# EAGLE design SafePrinterBoard_0_6 (EAGLE 9.6.2)
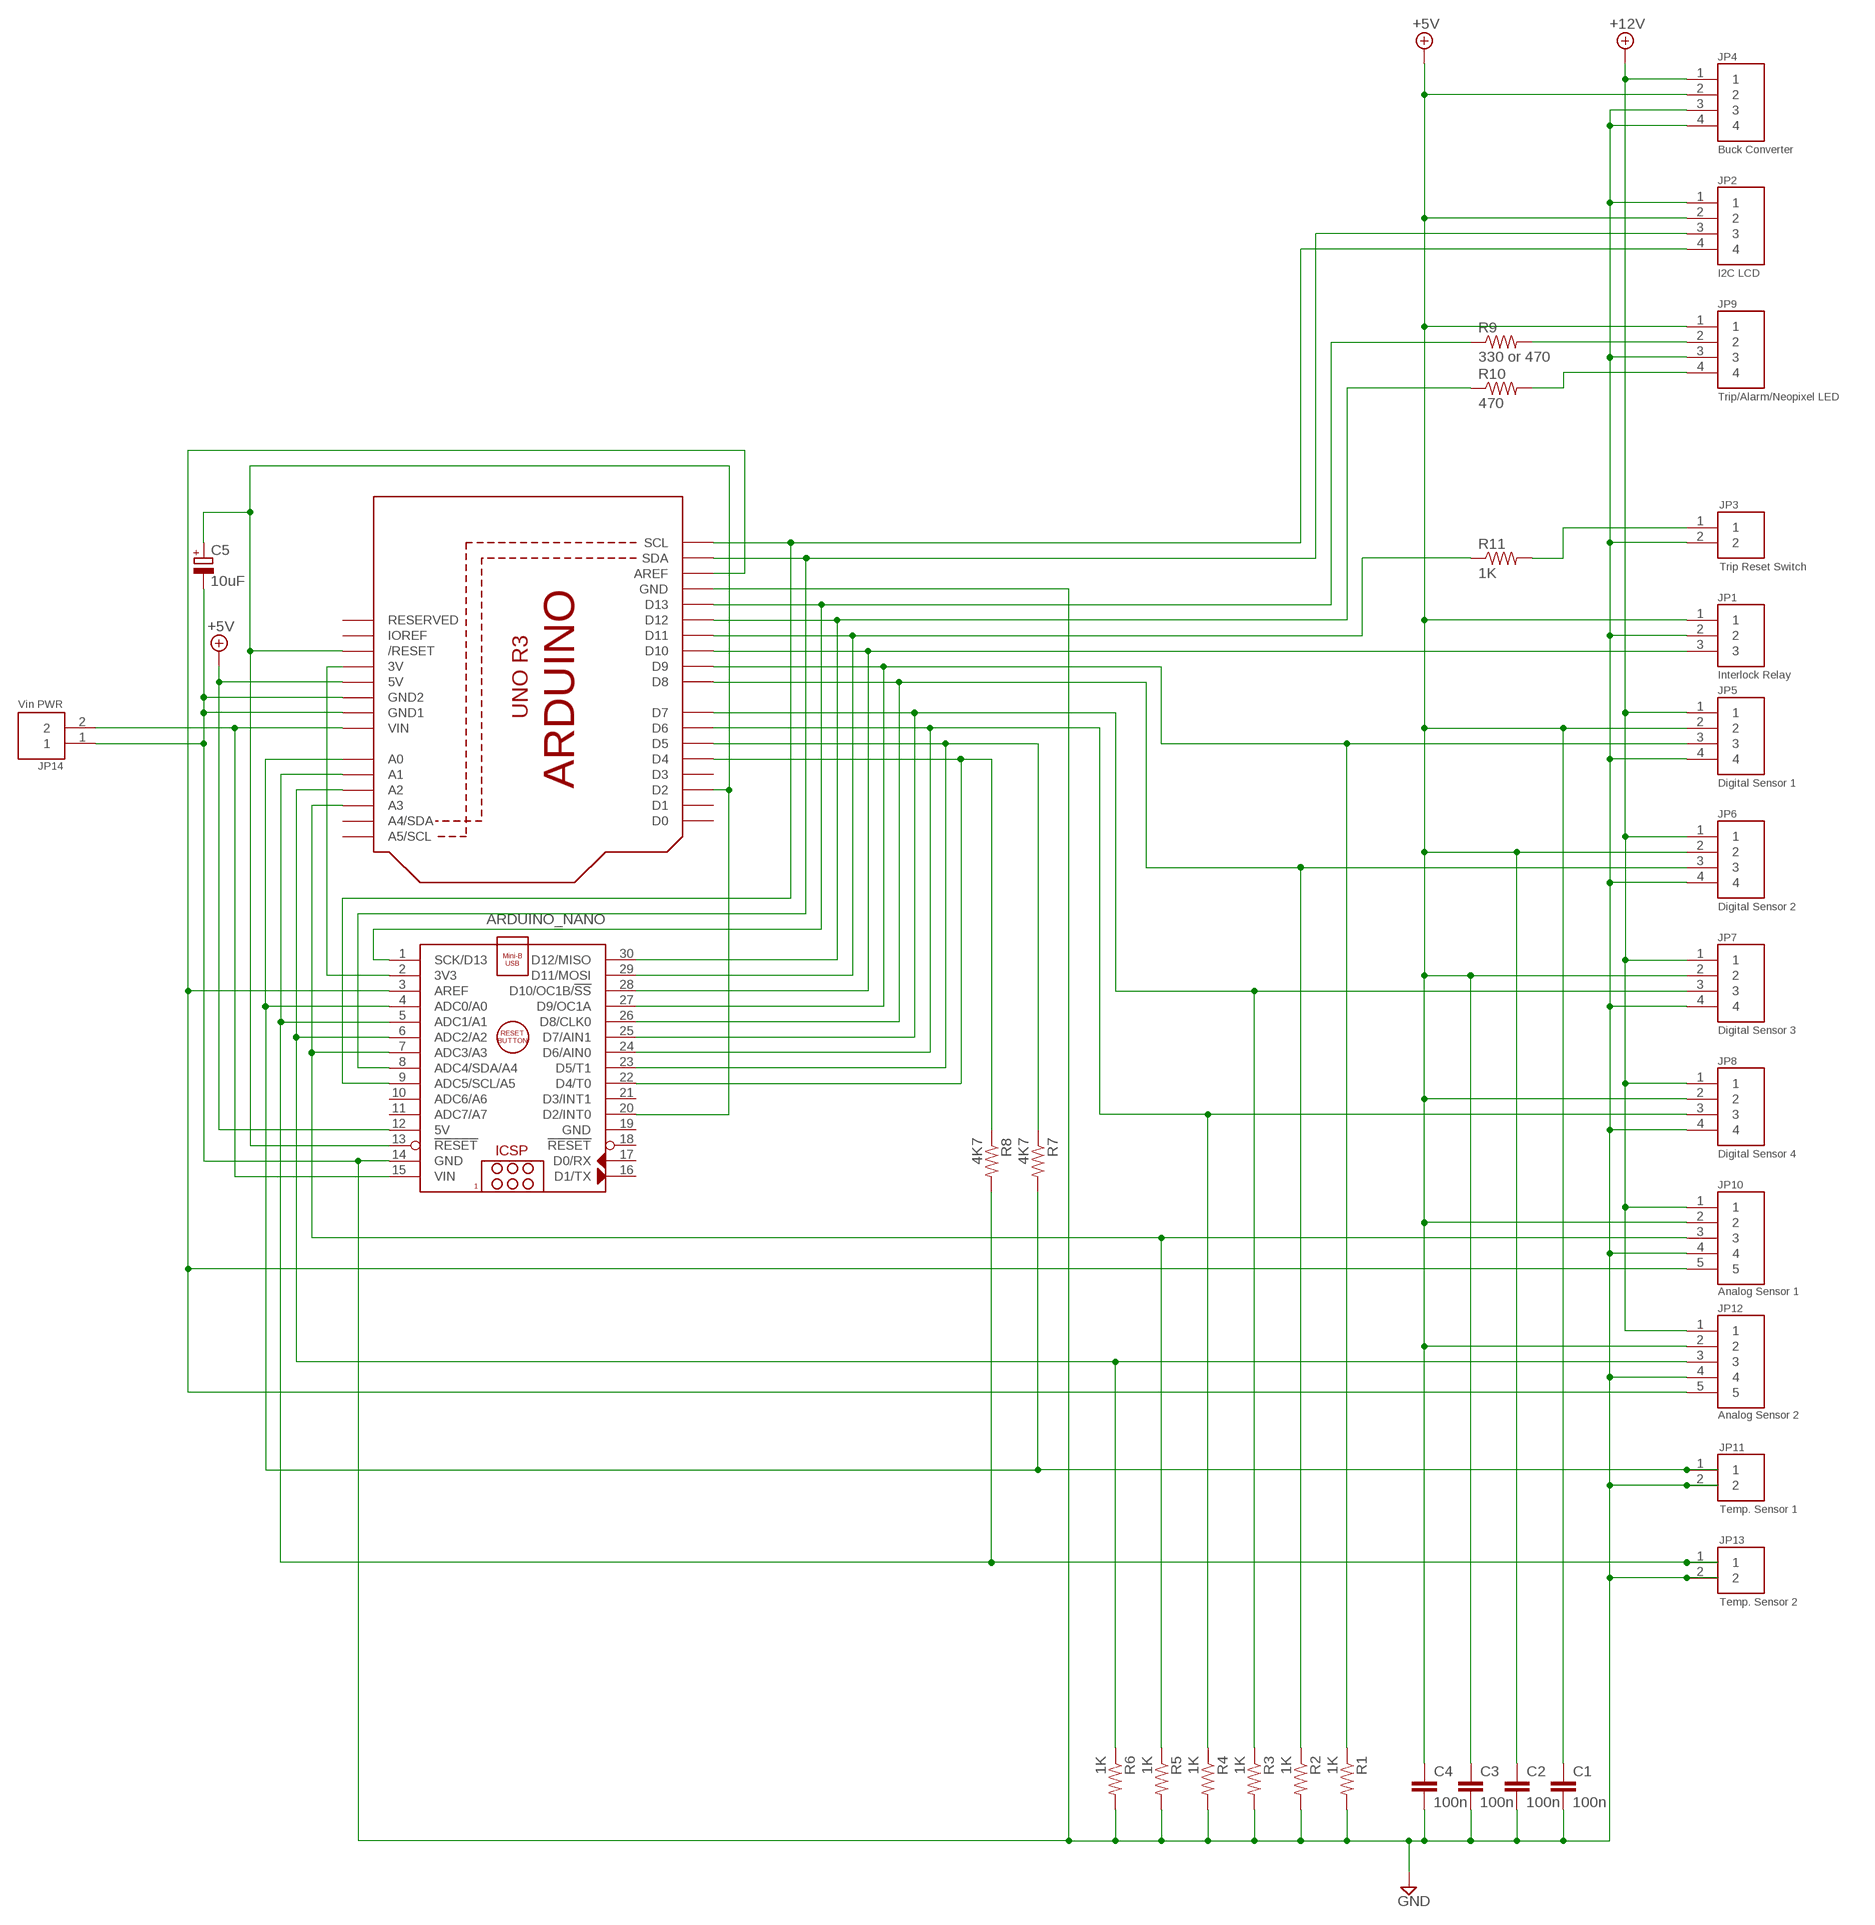
[diagram p0: schematic, sheet 1]

## Parts
ARDUINO_NANO  ARDUINO_NANO  [ARDUINO_NANO]
C1  100n  C-EU025-025X050  [C025-025X050]
C2  100n  C-EU025-025X050  [C025-025X050]
C3  100n  C-EU025-025X050  [C025-025X050]
C4  100n  C-EU025-025X050  [C025-025X050]
C5  10uF  CPOL-EUE2-5  [E2-5]
JP1  Interlock Relay  3PIN  [B3B-PH-K-S]
JP2  I2C LCD  4PIN  [B4B-PH-K-S]
JP3  Trip Reset Switch  2PIN  [B2B-PH-K-S]
JP4  Buck Converter  4PIN  [B4B-PH-K-S]
JP5  Digital Sensor 1  4PIN  [B4B-PH-K-S]
JP6  Digital Sensor 2  4PIN  [B4B-PH-K-S]
JP7  Digital Sensor 3  4PIN  [B4B-PH-K-S]
JP8  Digital Sensor 4  4PIN  [B4B-PH-K-S]
JP9  Trip/Alarm/Neopixel LED  4PIN  [B4B-PH-K-S]
JP10  Analog Sensor 1  5PIN  [B5B-PH-K-S]
JP11  Temp. Sensor 1  2PIN  [B2B-PH-K-S]
JP12  Analog Sensor 2  5PIN  [B5B-PH-K-S]
JP13  Temp. Sensor 2  2PIN  [B2B-PH-K-S]
JP14  Vin PWR  2PIN  [B2B-PH-K-S]
R1  1K  FLIPFLOP-RES  [0805-THM]
R2  1K  FLIPFLOP-RES  [0805-THM]
R3  1K  FLIPFLOP-RES  [0805-THM]
R4  1K  FLIPFLOP-RES  [0805-THM]
R5  1K  FLIPFLOP-RES  [0805-THM]
R6  1K  FLIPFLOP-RES  [0805-THM]
R7  4K7  FLIPFLOP-RES  [0805-THM]
R8  4K7  FLIPFLOP-RES  [0805-THM]
R9  330 or 470  FLIPFLOP-RES  [0805-THM]
R10  470  FLIPFLOP-RES  [0805-THM]
R11  1K  FLIPFLOP-RES  [0805-THM]
U1  ARDUINOR3-BPLACE  [ARDUINOR3-BPLACE]

## Nets
+5V: ARDUINO_NANO.12(5V) C1.1 C2.1 C3.1 C4.1 JP1.1 JP2.2 JP4.2 JP5.2 JP6.2 JP7.2 JP8.2 JP9.1 JP10.2 JP12.2 U1.5V
+12V: JP4.1 JP5.1 JP6.1 JP7.1 JP8.1 JP10.1 JP12.1
GND4: ARDUINO_NANO.14(GND) C1.2 C2.2 C3.2 C4.2 C5.- JP1.2 JP2.1 JP3.2 JP4.3 JP4.4 JP5.4 JP6.4 JP7.4 JP8.4 JP9.3 JP10.4 JP11.2 JP12.4 JP13.2 JP14.1 R1.2 R2.2 R3.2 R4.2 R5.2 R6.2 U1.GND U1.GND1 U1.GND2 ; supply symbol labelled GND
N$1: ARDUINO_NANO.28(D10/OC1B/!SS) JP1.3 U1.D10
N$2: ARDUINO_NANO.24(D6/AIN0) JP8.3 R4.1 U1.D6
N$3: JP9.2 R9.2
N$4: ARDUINO_NANO.26(D8/CLK0) JP6.3 R2.1 U1.D8
N$5: ARDUINO_NANO.25(D7/AIN1) JP7.3 R3.1 U1.D7
N$6: ARDUINO_NANO.27(D9/OC1A) JP5.3 R1.1 U1.D9
N$7: ARDUINO_NANO.1(SCK/D13) R9.1 U1.D13
N$8: ARDUINO_NANO.30(D12/MISO) R10.1 U1.D12
N$9: ARDUINO_NANO.29(D11/MOSI) R11.1 U1.D11
N$10: ARDUINO_NANO.9(ADC5/SCL/A5) JP2.4 U1.SCL
N$11: ARDUINO_NANO.8(ADC4/SDA/A4) JP2.3 U1.SDA
N$12: ARDUINO_NANO.23(D5/T1) R7.1 U1.D5
N$13: JP9.4 R10.2
N$14: ARDUINO_NANO.22(D4/T0) R8.1 U1.D4
N$15: ARDUINO_NANO.7(ADC3/A3) JP10.3 R5.1 U1.A3
N$16: ARDUINO_NANO.6(ADC2/A2) JP12.3 R6.1 U1.A2
N$19: ARDUINO_NANO.13(!RESET) ARDUINO_NANO.20(D2/INT0) C5.+ U1.D2 U1.RESET(/RESET)
N$20: ARDUINO_NANO.15(VIN) JP14.2 U1.VIN
N$21: ARDUINO_NANO.4(ADC0/A0) JP11.1 R7.2 U1.A0
N$22: ARDUINO_NANO.5(ADC1/A1) JP13.1 R8.2 U1.A1
N$23: ARDUINO_NANO.3(AREF) JP10.5 JP12.5 U1.AREF
N$24: ARDUINO_NANO.2(3V3) U1.3V
N$27: JP3.1 R11.2
Unconnected: ARDUINO_NANO.10(ADC6/A6) ARDUINO_NANO.11(ADC7/A7) ARDUINO_NANO.16(D1/TX) ARDUINO_NANO.17(D0/RX) ARDUINO_NANO.18(!RESET) ARDUINO_NANO.21(D3/INT1) U1.A4(A4/SDA) U1.A5(A5/SCL) U1.D0 U1.D1 U1.D3 U1.IOREF U1.RESERVED

## Power pins joined to a net without a drawn wire
GND4: ARDUINO_NANO.19(GND)

## Library data of the parts
ARDUINO_NANO = ArduinoNanoV30:ARDUINO_NANO: Arduino Nano V3.0 Module Overview: The Arduino Nano is a small, complete, and breadboard-friendly board based on the ATmega328 (Arduino Nano 3.x) or ATmega168 (Arduino Nano 2.x). It has more or less the same functionality of the Arduino Duemilanove, but in a different package. It lacks only a DC power jack, and works with a Mini-B USB cable instead of a standard one. The Nano was designed and is being produced by Gravitech <http://www.gravitech.us/arna30wiatp.html>. General specifications: Item Value Microcontroller Atmel ATmega168 or ATmega328 Operating Voltage (logic level) 5 V Input Voltage (recommended) 7-12 V Input Voltage (limits) 6-20 V Digital I/O Pins 14 (of which 6 provide PWM output) Analog Input Pins 8 DC Current per I/O Pin 40 mA Flash Memory 16 KB (ATmega168) or 32 KB (ATmega328) of which 2 KB used by bootloader SRAM 1 KB (ATmega168) or 2 KB (ATmega328) EEPROM 512 bytes (ATmega168) or 1 KB (ATmega328) Clock Speed 16 MHz Dimensions (Inches) 0.73" x 1.70" Dimensions (mm) 18mm x 45mm Overall height About 9 mm (not including pins) Weigth 5 g Power: The Arduino Nano can be powered via the Mini-B USB connection, 6-20V unregulated external power supply (pin 30), or 5V regulated external power supply (pin 27). The power source is automatically selected to the highest voltage source. Memory: The ATmega168 has 16 KB of flash memory for storing code (of which 2 KB is used for the bootloader); the ATmega328 has 32 KB, (also with 2 KB used for the bootloader). The ATmega168 has 1 KB of SRAM and 512 bytes of EEPROM (which can be read and written with the EEPROM library); the ATmega328 has 2 KB of SRAM and 1 KB of EEPROM. Input and Output: Each of the 14 digital pins on the Nano can be used as an input or output, using pinMode(), digitalWrite(), and digitalRead() functions. They operate at 5 volts. Each pin can provide or receive a maximum of 40 mA and has an internal pull-up resistor (disconnected by default) of 20-50 kOhms. In addition, some pins have specialized functions. Visit Arduino - ArduinoBoardNano <https://www.arduino.cc/en/Main/ArduinoBoardNano>
C1-C4 = rcl:C-EU: CAPACITOR, European symbol; SPICEPREFIX: C
C5 = rcl:CPOL-EU: POLARIZED CAPACITOR, European symbol; SPICEPREFIX: C
JP1 = RodrigoCesar:3PIN
JP2 JP4-JP9 = RodrigoCesar:4PIN
JP3 JP11 JP13 JP14 = RodrigoCesar:2PIN
JP10 JP12 = RodrigoCesar:5PIN
R1-R11 = adafruit:FLIPFLOP-RES: Flip Flop resistor An 0805 resistor inside a standard 1/4W 5% resistor. Makes for easy mods
U1 = adafruit:ARDUINOR3: This is a new object for the new Arduino R3 - with extra pins that you may want to use (such as IOref, and duplicated A4/A5

## Board
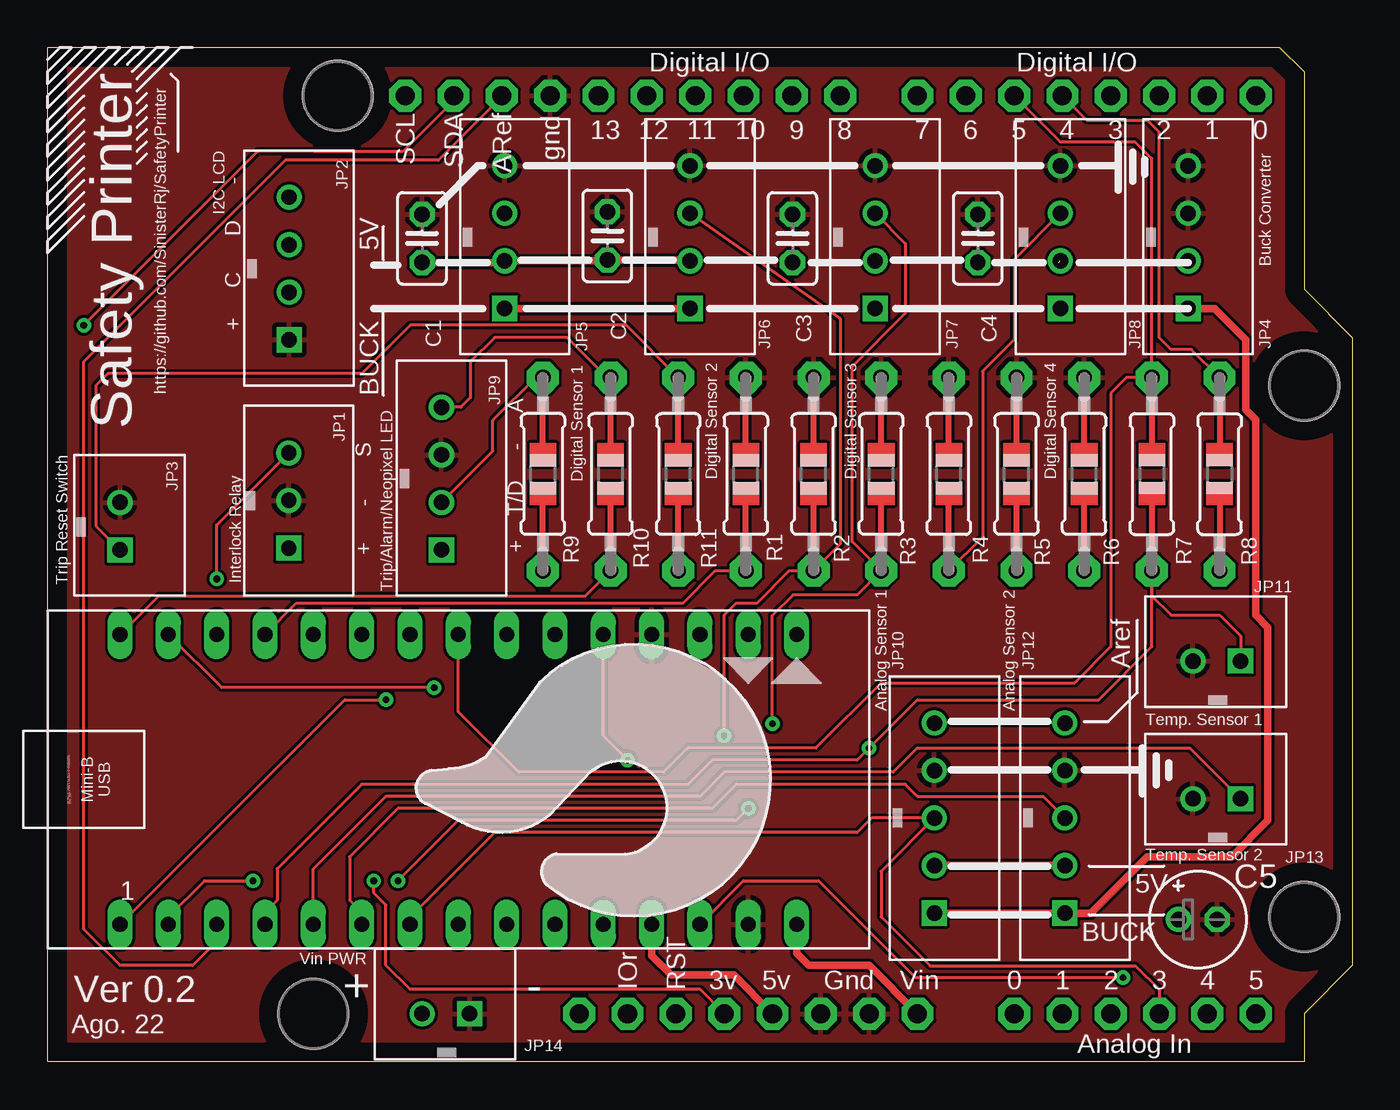
[diagram p1: board, top side]
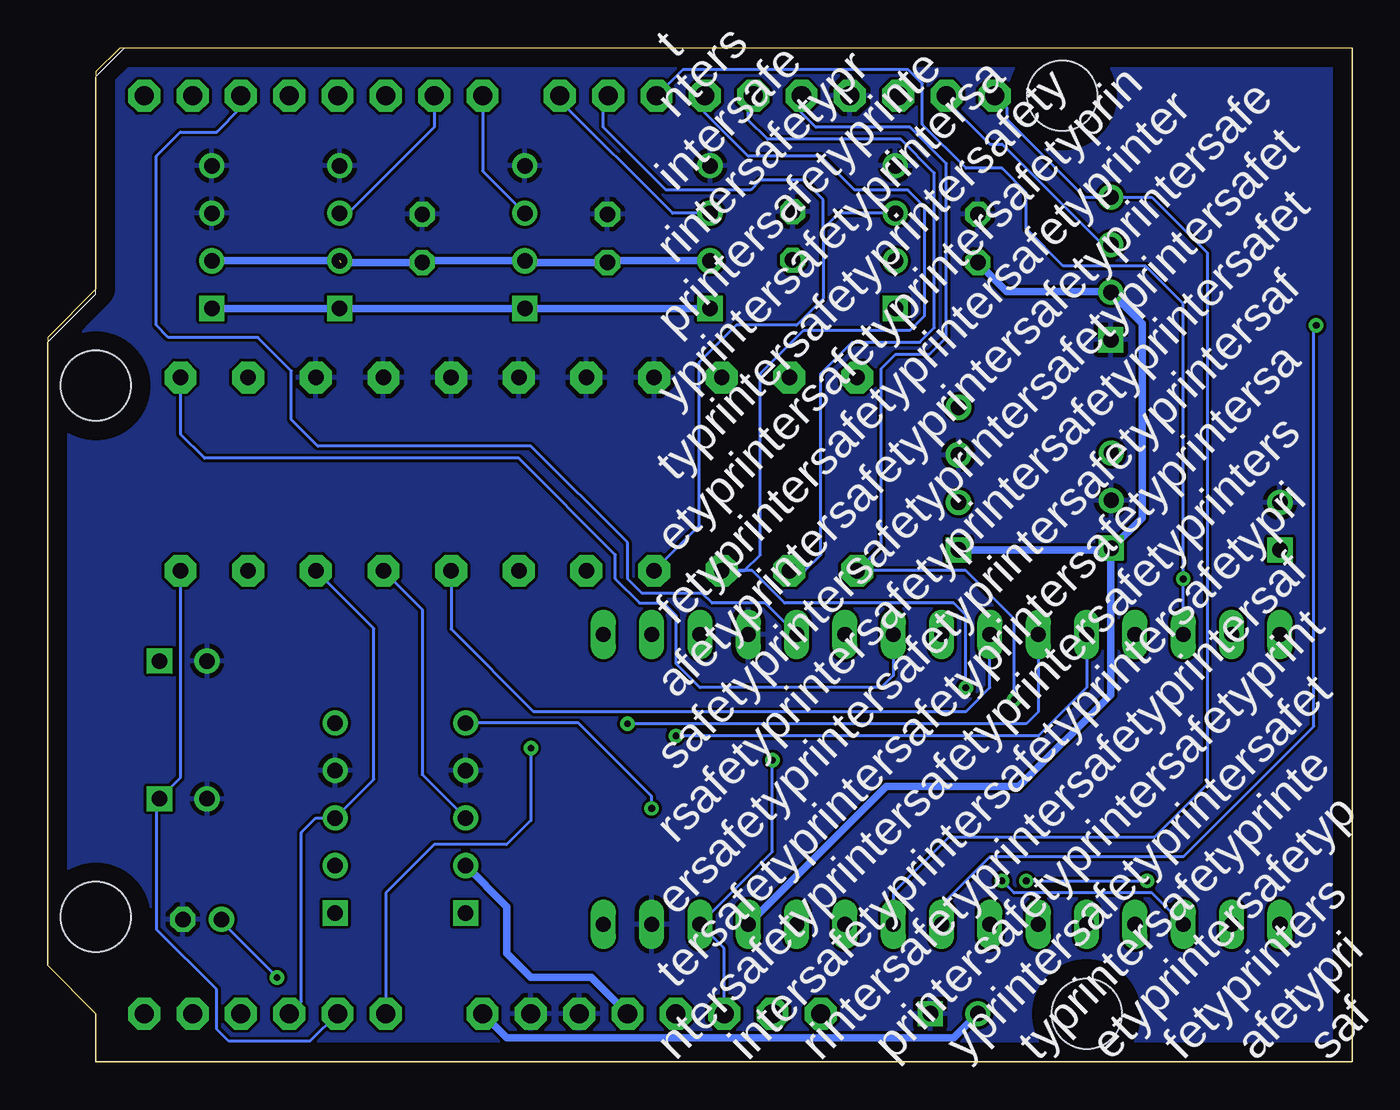
[diagram p2: board, bottom side, seen from below]

Size 68.58 x 53.34 mm. Coordinates in mm from the lower left corner, seen from the top.
Outline: 64.77,53.34 66.04,52.07 66.04,40.64 68.58,38.1 68.58,5.08 66.04,2.54 66.04,0 0.02,0 0,0.02 0,53.34 64.77,53.34
Outline: 64.77,53.34 64.77,53.34
Copper layers (1*16): Top 0.035mm / dielectric 1.6mm / Bottom 0.035mm
Design rules "default *": minimum track width 6mil, minimum drill 0.35mm, track to track 6mil, track to pad 6mil, pad to pad 6mil, via to via 6mil, smd to smd 6mil, copper to edge 40mil, drill to drill 6mil, minimum pad ring 10mil, minimum via ring 8mil, stop-mask expansion 4mil, vias tented up to drill 0mil, thermal gap 10mil
Holes 3.68 mm at 15.24,50.8 13.97,2.54 66.04,7.62 66.04,35.56
tKeepout: area 0,32.4 to 9.5,44.5

### Footprints (pad centres in the part's own frame; a part is rotated, then mirrored left to right if it is on the bottom)
ARDUINO_NANO = drill 0.8 long: 1 -20.32,-7.62; 2 -17.78,-7.62; 3 -15.24,-7.62; 4 -12.7,-7.62; 5 -10.16,-7.62; 6 -7.62,-7.62; 7 -5.08,-7.62; 8 -2.54,-7.62; 9 0,-7.62; 10 2.54,-7.62; 11 5.08,-7.62; 12 7.62,-7.62; 13 10.16,-7.62; 14 12.7,-7.62; 15 15.24,-7.62; 16 15.24,7.62; 17 12.7,7.62; 18 10.16,7.62; 19 7.62,7.62; 20 5.08,7.62; 21 2.54,7.62; 22 0,7.62; 23 -2.54,7.62; 24 -5.08,7.62; 25 -7.62,7.62; 26 -10.16,7.62; 27 -12.7,7.62; 28 -15.24,7.62; 29 -17.78,7.62; 30 -20.32,7.62
C025-025X050 = drill 0.813 octagon: 1 -1.27,0; 2 1.27,0
E2-5 = drill 0.813 pad 1.27: + -1.016,0 | drill 0.813 pad 1.27 octagon: - 1.016,0
B3B-PH-K-S = drill 0.813 square: 1 2.5,0 | drill 0.813: 2 0,0; 3 -2.5,0
B4B-PH-K-S = drill 0.813 square: 1 0,0 | drill 0.813: 2 -2.5,0; 3 -5,0; 4 -7.5,0
B2B-PH-K-S = drill 0.813 square: 1 2.5,0 | drill 0.813: 2 0,0
B5B-PH-K-S = drill 0.813 square: 1 5,0 | drill 0.813: 2 2.5,0; 3 0,0; 4 -2.5,0; 5 -5,0
0805-THM = drill 0.813 pad 1.676 octagon: 1 -5.08,0; 2 5.08,0
ARDUINOR3-BPLACE = drill 1 pad 1.676 octagon: 3V 35.56,2.54; 5V 38.1,2.54; A0 50.8,2.54; A1 53.34,2.54; A2 55.88,2.54; A3 58.42,2.54; A4 60.96,2.54; A5 63.5,2.54; AREF 23.876,50.8; D0 63.5,50.8; D1 60.96,50.8; D2 58.42,50.8; D3 55.88,50.8; D4 53.34,50.8; D5 50.8,50.8; D6 48.26,50.8; D7 45.72,50.8; D8 41.656,50.8; D9 39.116,50.8; D10 36.576,50.8; D11 34.036,50.8; D12 31.496,50.8; D13 28.956,50.8; GND 26.416,50.8; GND1 43.18,2.54; GND2 40.64,2.54; IOREF 30.48,2.54; RESERVED 27.94,2.54; RESET 33.02,2.54; SCL 18.796,50.8; SDA 21.336,50.8; VIN 45.72,2.54

### Placement (x,y rotation side)
ARDUINO_NANO  24.13,14.86 0 top
C1  19.68,43.31 90 top
C2  29.42,43.43 90 top
C3  39.15,43.31 90 top
C4  48.89,43.31 90 top
C5  60.45,7.49 0 top
JP1  12.68,29.52 270 top
JP2  12.7,37.97 270 top
JP3  3.81,29.42 270 top
JP4  59.94,39.62 270 top
JP5  24.03,39.62 270 top
JP6  33.76,39.62 270 top
JP7  43.5,39.62 270 top
JP8  53.23,39.62 270 top
JP9  20.7,26.92 270 top
JP10  46.61,12.83 270 top
JP11  60.2,21.08 0 top
JP12  53.47,12.83 270 top
JP13  60.2,13.84 0 top
JP14  19.68,2.54 0 top
R1  36.7,30.91 90 top
R2  40.26,30.91 90 top
R3  43.81,30.91 90 top
R4  47.37,30.91 90 top
R5  50.93,30.91 90 top
R6  54.48,30.91 90 top
R7  58.04,30.91 270 top
R8  61.59,30.91 270 top
R9  26.04,30.91 90 top
R10  29.59,30.91 90 top
R11  33.15,30.91 90 top
U1  0,0 0 top

### Tracks (layer width: path | path; a pad name or v marks a point on that pad's centre or on a via)
+5V  (1 unrouted)
  Top 0.406: ARDUINO_NANO.12 31.75,5.59 32.77,4.57 36.07,4.57 U1.5V | JP12.2 JP10.2 | C1.1 23.94,42.04 JP5.2 29.38,42.12 C2.1 33.72,42.16 JP6.2
  Bottom 0.406: ARDUINO_NANO.12 24.51,14.48 17.53,14.48 12.7,19.3 12.7,27 JP1.1 | JP6.2 39.07,42.12 C3.1 43.41,42.04 JP7.2 48.8,42.12 C4.1 53.14,42.04 | U1.5V 40,4.45 43.18,4.45 44.45,5.71 44.45,8.17 JP10.2 | JP8.2 JP4.2 | JP1.1 12.64,27.02 11.05,28.62 11.05,38.82 JP2.2 12.74,40.51 18.16,40.51 C1.1 | JP1.1 12.78,26.92 JP9.1
+12V
  Top 0.406: JP6.1 JP5.1 | JP10.1 JP12.1 54.82,7.83 57.78,10.79 62.23,10.79 64.13,12.7 64.13,22.86 63.5,23.49 63.5,33.77 62.98,34.29 62.98,37.99 61.34,39.62 JP4.1
  Bottom 0.406: JP6.1 JP7.1 JP8.1 JP4.1
GND4
  pour Top: 0,0 66.04,0 66.04,2.54 68.58,5.08 68.58,38.1 66.04,40.64 66.04,52.07 64.77,53.34 0,53.34
  pour Bottom: 0,53.34 0,0 66.04,0 66.04,2.54 68.58,5.08 68.58,38.1 66.04,40.64 66.04,52.07 64.77,53.34
N$1  (via drill 0.35)
  Top 0.152: v8.89,25.4 8.89,28.24 JP1.3
  Bottom 0.152: U1.D10 35.2,52.17 23.33,52.17 22.61,51.45 22.61,49.29 20.31,46.99 18.42,46.99 17.14,45.72 17.14,43.81 15.19,41.86 10.87,41.86 8.89,39.88 v8.89,25.4 ARDUINO_NANO.28
N$2
  Top 0.152: JP8.3 50.8,42.19 50.8,37.97 49.15,36.32 49.15,27.61 R4.1
  Bottom 0.152: R4.1 47.37,22.76 43.03,18.41 20.32,18.41 19.05,19.68 ARDUINO_NANO.24 | U1.D6 48.26,49.15 52.78,44.62 JP8.3
N$3
  Top 0.152: R9.2 25.65,35.99 23.41,33.74 23.41,32.13 JP9.2
N$4  (via drill 0.35)
  Top 0.152: JP6.3 41.66,39.08 41.66,27.23 R2.1 38.99,25.83 37.29,24.13 36.19,24.13 35.56,23.49 v35.56,17.14
  Bottom 0.152: U1.D8 41.78,50.67 35.73,44.62 JP6.3 | ARDUINO_NANO.26 13.97,19.68 16.51,17.14 v35.56,17.14
N$5  (via drill 0.35)
  Top 0.152: v38.1,17.78 38.1,23.48 39.18,24.56 42.55,24.56 R3.1 42.29,27.36 42.29,36.58 45.08,39.37 45.08,43.03 JP7.3
  Bottom 0.152: ARDUINO_NANO.25 16.51,18.41 17.14,17.78 v38.1,17.78 | JP7.3 45.72,46.85 U1.D7
N$6
  Top 0.152: ARDUINO_NANO.27 13.08,24.13 33.4,24.13 35.1,25.83 R1.1
  Bottom 0.152: 27.81,43.81 27.81,45.34 28.83,46.35 31.11,46.35 31.62,45.85 36.07,45.85 39.37,49.15 39.37,50.55 U1.D9 | R1.1 34.35,28.19 34.35,36.77 32.39,38.73 29.21,38.73 27.81,40.13 27.81,43.81 | JP5.3 27,44.62 27.81,43.81
N$7  (via drill 0.35)
  Top 0.152: ARDUINO_NANO.1 15.62,19.05 v17.78,19.05
  Bottom 0.152: U1.D13 28.96,49.91 28.19,49.15 23.24,49.15 21.34,47.24 21.34,38.1 22.22,37.21 24,37.21 24.76,36.45 24.76,27.1 R9.1 20.32,25.83 17.78,23.29 v17.78,19.05
N$8
  Top 0.152: ARDUINO_NANO.30 5.84,24.51 28.27,24.51 R10.1
  Bottom 0.152: U1.D12 31.75,50.55 31.75,49.53 30.73,48.51 23.75,48.51 21.97,46.74 21.97,38.61 22.73,37.85 26.29,37.85 27.94,36.2 27.94,26.67 28.78,25.83 R10.1
N$9  (via drill 0.35)
  Top 0.152: ARDUINO_NANO.29 9.14,19.68 v20.32,19.68
  Bottom 0.152: U1.D11 34.04,49.91 31.75,47.62 27.94,47.62 26.16,45.85 23.37,45.85 22.48,44.96 22.48,39.24 23.24,38.48 28.83,38.48 31.11,36.2 31.11,26.67 31.95,25.83 R11.1 31.55,25.83 29.85,24.13 20.96,24.13 20.32,23.49 v20.32,19.68
N$10
  Bottom 0.152: ARDUINO_NANO.9 24.13,8.89 21.21,11.81 10.41,11.81 7.62,14.61 7.62,42.55 10.55,45.47 JP2.4 14.06,45.47 18.17,49.59 18.17,50.18 U1.SCL
N$11  (via drill 0.35)
  Top 0.152: U1.SDA 21.34,50.55 18.66,47.87 14.03,47.87 14.01,47.88 11.05,47.88 v1.91,38.73
  Bottom 0.152: ARDUINO_NANO.8 21.59,8.25 19.05,10.79 8.89,10.79 2.03,17.65 2.03,38.73 v1.91,38.73 | U1.SDA 21.34,50.55 19.05,48.26 18.42,48.26 13.13,42.97 JP2.3
N$12
  Top 0.152: ARDUINO_NANO.23 21.59,18.41 24.76,15.24 32.39,15.24 33.66,16.51 40.39,16.51 43.81,19.94 53.97,19.94 55.88,21.84 55.88,35.17 56.7,35.99 R7.1 58.04,47.5 57.15,48.39 53.21,48.39 U1.D5
N$13
  Top 0.152: R10.2 29.41,35.99 27.31,38.1 23.5,38.1 22.22,36.83 22.22,34.92 21.72,34.42 JP9.4
N$14
  Top 0.152: U1.D4 54.61,49.53 57.78,49.53 58.42,48.89 58.42,38.1 59.05,37.46 60.12,37.46 R8.1
  Bottom 0.152: R8.1 61.59,33.02 60.33,31.75 43.81,31.75 38.73,26.67 38.73,25.4 37.47,24.13 36.19,24.13 35.56,23.49 35.56,20.95 34.29,19.68 24.76,19.68 24.13,20.32 ARDUINO_NANO.22
N$15
  Top 0.152: ARDUINO_NANO.7 19.05,7.62 23.5,12.06 42.55,12.06 43.31,12.83 JP10.3 43.81,10.03 43.81,7.62 46.38,5.05 57.18,5.05 58.42,3.81 U1.A3
  Bottom 0.152: R5.1 48.89,23.8 48.89,15.11 JP10.3
N$16
  Top 0.152: ARDUINO_NANO.6 16.51,7.87 15.88,8.51 15.88,10.79 18.42,13.34 34.92,13.34 36.19,14.61 45.08,14.61 45.72,13.97 52.32,13.97 JP12.3
  Bottom 0.152: R6.1 51.44,22.78 51.44,14.86 JP12.3 54.48,12.83 55.24,12.06 55.24,3.17 U1.A2
N$19  (via drill 0.35)
  Top 0.152: ARDUINO_NANO.13 36.58,9.52 40.52,9.52 45.6,4.45 v56.52,4.45 | v30.48,15.88 29.21,17.14 ARDUINO_NANO.20
  Bottom 0.152: ARDUINO_NANO.20 30.86,24.13 33.66,24.13 34.16,24.64 37.34,24.64 38.1,25.4 38.1,27.3 43.18,32.38 54.37,32.38 55.76,33.77 55.76,36.33 57.53,38.1 62.23,38.1 62.86,38.73 62.86,47.62 61.59,48.89 59.69,48.89 58.42,50.16 U1.D2 | v56.52,4.45 59.44,7.37 C5.+ | U1.RESET 33.02,5.97 ARDUINO_NANO.13 30.48,11.05 v30.48,15.88
N$20
  Top 0.406: ARDUINO_NANO.15 39.37,5.71 40,5.08 43.18,5.08 U1.VIN
  Bottom 0.406: JP14.2 20.96,1.27 44.45,1.27 U1.VIN
N$21  (via drill 0.35)
  Top 0.152: ARDUINO_NANO.4 11.43,7.87 12.07,8.51 12.07,10.16 16.51,14.61 33.66,14.61 34.92,15.88 42.55,15.88 v43.18,16.51 45.72,19.05 55.24,19.05 58.04,21.84 R7.2 58.04,24.51 59.05,23.49 61.59,23.49 62.7,22.39 JP11.1
  Bottom 0.152: v43.18,16.51 43.18,12.7 44.45,11.43 48.26,11.43 50.8,8.89 U1.A0
N$22
  Top 0.152: ARDUINO_NANO.5 13.97,10.16 17.78,13.97 34.29,13.97 35.56,15.24 44.45,15.24 45.72,16.51 60.03,16.51 JP13.1
  Bottom 0.152: R8.2 | R8.2 61.59,14.95 JP13.1 62.86,13.68 62.86,6.98 59.69,3.81 59.69,1.73 59.05,1.09 54.79,1.09 U1.A1
N$23  (via drill 0.35)
  Top 0.152: U1.AREF 23.82,50.7 20.54,47.41 12.48,47.41 1.91,36.83 1.91,6.98 3.81,5.08 7.62,5.08 8.89,6.35 ARDUINO_NANO.3 | JP12.5 JP10.5 | v36.83,13.34 36.19,12.7 21.59,12.7 v18.42,9.52
  Bottom 0.152: ARDUINO_NANO.3 10.54,8.89 17.78,8.89 v18.42,9.52 | v36.83,13.34 36.83,13.97 40.69,17.83 JP10.5
N$24  (via drill 0.35)
  Top 0.152: U1.3V 34.29,3.81 19.05,3.81 17.78,5.08 17.78,8.25 17.14,8.89 v17.14,9.52 | ARDUINO_NANO.2 6.35,7.62 8.25,9.52 v10.79,9.52
  Bottom 0.152: v17.14,9.52 v10.79,9.52
N$27
  Top 0.152: R11.2 30.4,38.73 19.05,38.73 16.51,36.2 3.18,36.2 2.54,35.56 2.54,28.19 JP3.1

### Text on the board
tPlace: 5V | + C D - | BUCK | + - S | + T/D - A | Aref | 5V | BUCK
tNames: https://github.com/SinisterRj/SafetyPrinter | Safety Printer | Ver 0.2 | + - | Ago. 22
bNames: t | nters | intersafe | rintersafetypr | printersafetyprinte | yprintersafetyprintersa | typrintersafetyprintersafety | etyprintersafetyprintersafetyprin | fetyprintersafetyprintersafetyprinter | afetyprintersafetyprintersafetyprintersafe | safetyprintersafetyprintersafetyprintersafet | rsafetyprintersafetyprintersafetyprintersafet | ersafetyprintersafetyprintersafetyprintersaf | tersafetyprintersafetyprintersafetyprintersa | saf | afetypri | fetyprinters | etyprintersafetyp | typrintersafetyprinte | yprintersafetyprintersafet | printersafetyprintersafetyprint | rintersafetyprintersafetyprintersaf | intersafetyprintersafetyprintersafetypri | ntersafetyprintersafetyprintersafetyprinters